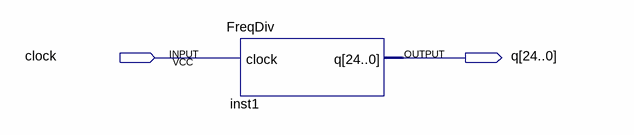
[diagram p0: schematic sheet]
// Quartus schematic clock_test.bdf as structural Verilog: 1 symbols, 2 pins
module clock_test (
  input  clock,
  output [24:0] q
);

  FreqDiv inst1 (.clock(clock), .q(q));
endmodule
